# Altium project FHJController_V5.0.PrjPcb (part 2 of 2)

## Sheet Debugging Interface.SchDoc: Debugging Interface
size A3; DocumentNumber: 4; SheetNumber: 4; SheetTotal: 6
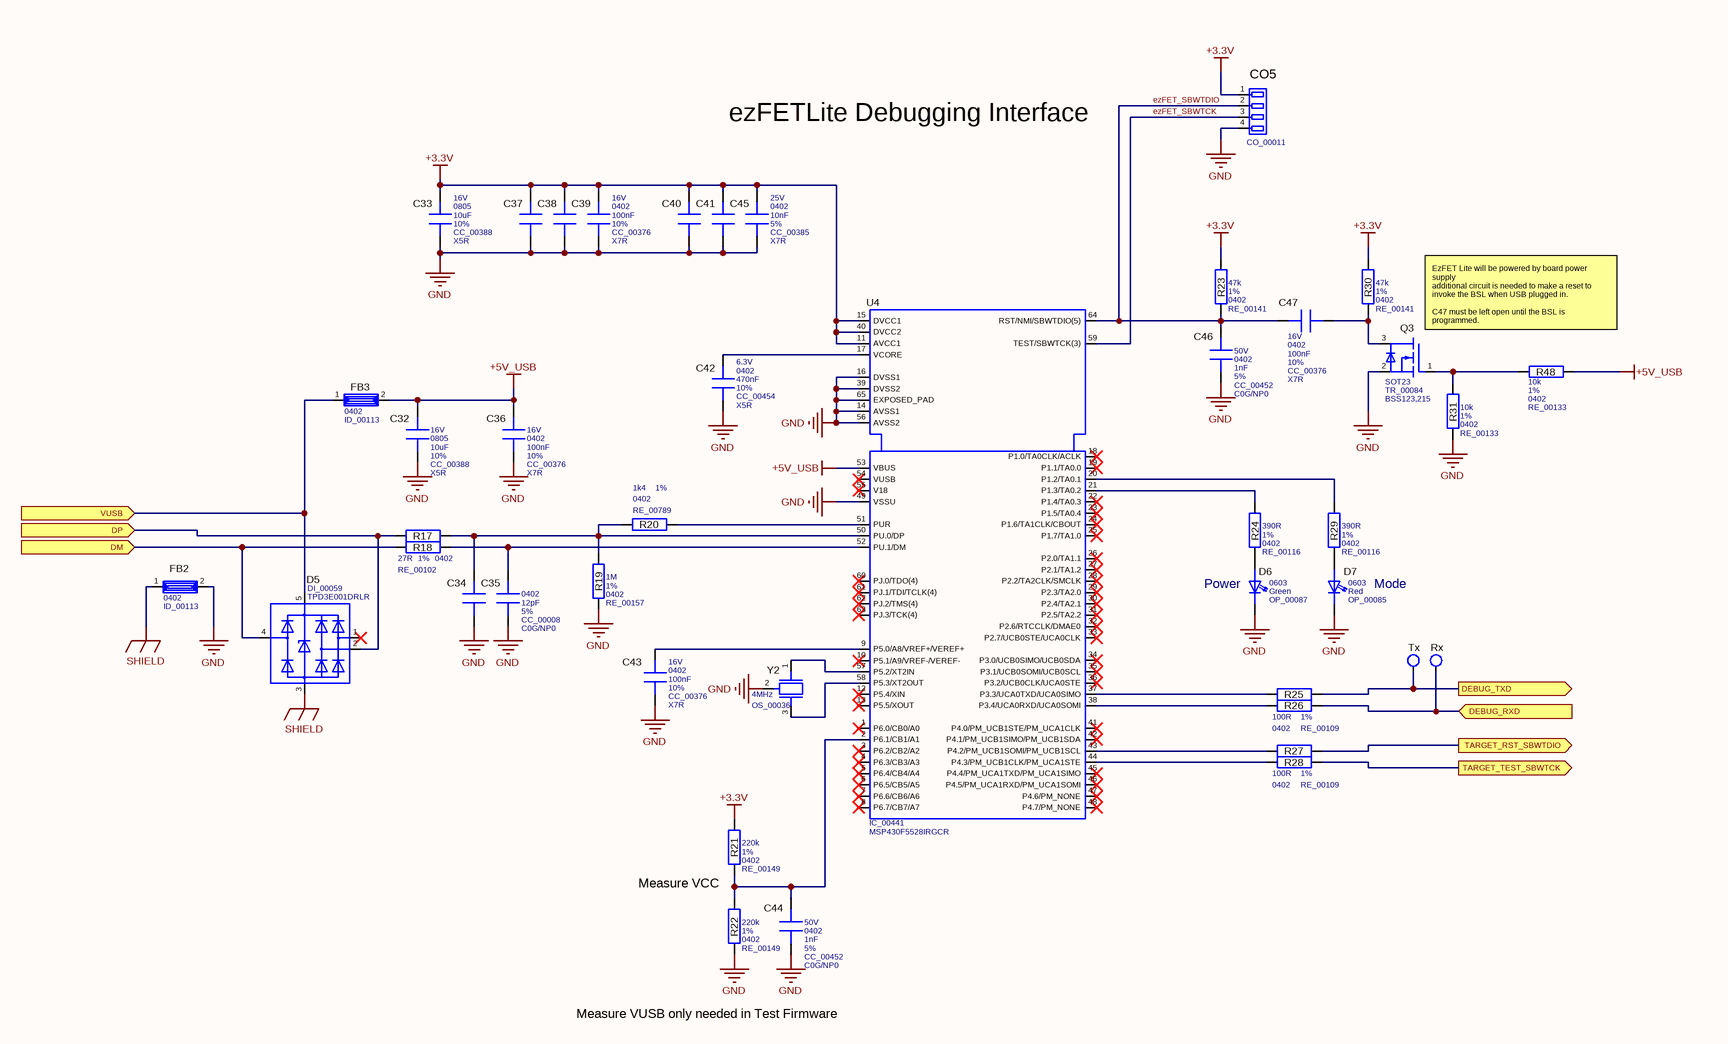
[diagram p4: Debugging Interface.SchDoc]

### Parts
C32  Voltage: 16V  Package: 0805  Capacitance: 10uF  Tolerance: 10%  Part_Number: CC_00388  Dielectric_Material: X5R  [CS2000x1250x1250x350x1650L]  (hidden comment: capacitor)
C33  Voltage: 16V  Package: 0805  Capacitance: 10uF  Tolerance: 10%  Part_Number: CC_00388  Dielectric_Material: X5R  [CS2000x1250x1250x350x1650L]  (hidden comment: capacitor)
C34  capacitor  [CS1000X500X560X250X820L]  (value not drawn)
C35  Package: 0402  Capacitance: 12pF  Tolerance: 5%  Part_Number: CC_00008  Dielectric_Material: C0G/NP0  [CS1000X500X560X250X820L]  (hidden comment: capacitor)
C36  Voltage: 16V  Package: 0402  Capacitance: 100nF  Tolerance: 10%  Part_Number: CC_00376  Dielectric_Material: X7R  [CS1000X500X560X250X820L]  (hidden comment: capacitor)
C37  capacitor  [CS1000X500X560X250X820L]  (value not drawn)
C38  capacitor  [CS1000X500X560X250X820L]  (value not drawn)
C39  Voltage: 16V  Package: 0402  Capacitance: 100nF  Tolerance: 10%  Part_Number: CC_00376  Dielectric_Material: X7R  [CS1000X500X560X250X820L]  (hidden comment: capacitor)
C40  capacitor  [CS1000X500X560X250X820L]  (value not drawn)
C41  capacitor  [CS1000X500X560X250X820L]  (value not drawn)
C42  Voltage: 6.3V  Package: 0402  Capacitance: 470nF  Tolerance: 10%  Part_Number: CC_00454  Dielectric_Material: X5R  [CS1000X500X560X250X820L]  (hidden comment: capacitor)
C43  Voltage: 16V  Package: 0402  Capacitance: 100nF  Tolerance: 10%  Part_Number: CC_00376  Dielectric_Material: X7R  [CS1000X500X560X250X820L]  (hidden comment: capacitor)
C44  Voltage: 50V  Package: 0402  Capacitance: 1nF  Tolerance: 5%  Part_Number: CC_00452  Dielectric_Material: C0G/NP0  [CS1000X500X560X250X820L]  (hidden comment: capacitor)
C45  Voltage: 25V  Package: 0402  Capacitance: 10nF  Tolerance: 5%  Part_Number: CC_00385  Dielectric_Material: X7R  [CS1000X500X560X250X820L]  (hidden comment: capacitor)
C46  Voltage: 50V  Package: 0402  Capacitance: 1nF  Tolerance: 5%  Part_Number: CC_00452  Dielectric_Material: C0G/NP0  [CS1000X500X560X250X820L]  (hidden comment: capacitor)
C47  Voltage: 16V  Package: 0402  Capacitance: 100nF  Tolerance: 10%  Part_Number: CC_00376  Dielectric_Material: X7R  [CS1000X500X560X250X820L]  (hidden comment: capacitor)
CO5  CO_00011  [CO_00011N]
D5  Manufacturer_Number: TPD3E001DRLR  [DI_00059N]  (hidden comment: DI_00059)
D6  Package: 0603  Color: Green  Part_Number: OP_00087  [OP_00087L]  (hidden comment: LED)
D7  Package: 0603  Color: Red  Part_Number: OP_00085  [OP_00085L]  (hidden comment: LED)
FB2  Package: 0402  Part_Number: ID_00113  [IS1000x500x500x200x800L]  (hidden comment: ferrit)
FB3  Package: 0402  Part_Number: ID_00113  [IS1000x500x500x200x800L]  (hidden comment: ferrit)
Q3  Package: SOT23  Part_Number: TR_00084  Manufacturer_Number: BSS123,215  [TR_00084N]  (hidden comment: nmosfet)
R17  Resistor  [RS1000X500X560X250X820L]  (value not drawn)
R18  Resistance: 27R  Tolerance: 1%  Package: 0402  Part_Number: RE_00102  [RS1000X500X560X250X820L]  (hidden comment: Resistor)
R19  Resistance: 1M  Tolerance: 1%  Package: 0402  Part_Number: RE_00157  [RS1000X500X560X250X820L]  (hidden comment: Resistor)
R20  Resistance: 1k4  Tolerance: 1%  Package: 0402  Part_Number: RE_00789  [RS1000X500X560X250X820L]  (hidden comment: Resistor)
R21  Resistance: 220k  Tolerance: 1%  Package: 0402  Part_Number: RE_00149  [RS1000X500X560X250X820L]  (hidden comment: Resistor)
R22  Resistance: 220k  Tolerance: 1%  Package: 0402  Part_Number: RE_00149  [RS1000X500X560X250X820L]  (hidden comment: Resistor)
R23  Resistance: 47k  Tolerance: 1%  Package: 0402  Part_Number: RE_00141  [RS1000X500X560X250X820L]  (hidden comment: Resistor)
R24  Resistance: 390R  Tolerance: 1%  Package: 0402  Part_Number: RE_00116  [RS1000X500X560X250X820L]  (hidden comment: Resistor)
R25  Resistor  [RS1000X500X560X250X820L]  (value not drawn)
R26  Resistance: 100R  Tolerance: 1%  Package: 0402  Part_Number: RE_00109  [RS1000X500X560X250X820L]  (hidden comment: Resistor)
R27  Resistor  [RS1000X500X560X250X820L]  (value not drawn)
R28  Resistance: 100R  Tolerance: 1%  Package: 0402  Part_Number: RE_00109  [RS1000X500X560X250X820L]  (hidden comment: Resistor)
R29  Resistance: 390R  Tolerance: 1%  Package: 0402  Part_Number: RE_00116  [RS1000X500X560X250X820L]  (hidden comment: Resistor)
R30  Resistance: 47k  Tolerance: 1%  Package: 0402  Part_Number: RE_00141  [RS1000X500X560X250X820L]  (hidden comment: Resistor)
R31  Resistance: 10k  Tolerance: 1%  Package: 0402  Part_Number: RE_00133  [RS1000X500X560X250X820L]  (hidden comment: Resistor)
R48  Resistance: 10k  Tolerance: 1%  Package: 0402  Part_Number: RE_00133  [RS1000X500X560X250X820L]  (hidden comment: Resistor)
Rx  testpoint  [CO_00057N]  (value not drawn)  (no BOM)
Tx  testpoint  [CO_00057N]  (value not drawn)  (no BOM)
U4  Manufacturer_Number: MSP430F5528IRGCR  [IC_00441N]  (hidden comment: IC_00441)
Y2  Part_Number: OS_00036  Nominal_frequency: 4MHz  [OS_00036N]  (hidden comment: ceramic_resonator)

### Ports
DEBUG_RXD (in), DEBUG_TXD (out), DM (in), DP (in), TARGET_RST_SBWTDIO (out), TARGET_TEST_SBWTCK (out), VUSB (in)

### Nets
+3.3V: C33.2(PIN2) C37.2(PIN2) C38.2(PIN2) C39.2(PIN2) C40.2(PIN2) C41.2(PIN2) C45.2(PIN2) CO5.1(PIN1) R21.2(PIN2) R23.2(PIN2) R30.2(PIN2) U4.11(AVCC1) U4.15(DVCC1) U4.40(DVCC2)
+5V_USB: C32.2(PIN2) C36.2(PIN2) FB3.2(PIN2) R48.1(PIN1) U4.53(VBUS)
GND: C32.1(PIN1) C33.1(PIN1) C34.1(PIN1) C35.1(PIN1) C36.1(PIN1) C37.1(PIN1) C38.1(PIN1) C39.1(PIN1) C40.1(PIN1) C41.1(PIN1) C42.1(PIN1) C43.1(PIN1) C44.1(PIN1) C45.1(PIN1) C46.1(PIN1) CO5.4(PIN4) D6.1(CATHODE) D7.1(CATHODE) FB2.2(PIN2) Q3.2(S) R19.1(PIN1) R22.1(PIN1) R31.1(PIN1) U4.14(AVSS1) U4.16(DVSS1) U4.39(DVSS2) U4.49(VSSU) U4.56(AVSS2) U4.65(EXPOSED_PAD) Y2.2(PIN2)
SHIELD: D5.3(GND) FB2.1(PIN1)
DEBUG_RXD: R26.2(PIN2) Rx.1(PIN1) ; port DEBUG_RXD
DEBUG_TXD: R25.2(PIN2) Tx.1(PIN1) ; port DEBUG_TXD
ezFET_SBWTCK: CO5.3(PIN3) U4.59(TEST/SBWTCK(3))
ezFET_SBWTDIO: C46.2(PIN2) C47.2(PIN2) CO5.2(PIN2) R23.1(PIN1) U4.64(RST/NMI/SBWTDIO(5))
TARGET_RST_SBWTDIO: R27.2(PIN2) ; port TARGET_RST_SBWTDIO
TARGET_TEST_SBWTCK: R28.2(PIN2) ; port TARGET_TEST_SBWTCK
VUSB: D5.5(VCC) FB3.1(PIN1) ; port VUSB
NetC34_2: C34.2(PIN2) R17.2(PIN2) R19.2(PIN2) R20.1(PIN1) U4.50(PU.0/DP)
NetC35_2: C35.2(PIN2) R18.2(PIN2) U4.52(PU.1/DM)
NetC42_2: C42.2(PIN2) U4.17(VCORE)
NetC43_2: C43.2(PIN2) U4.9(P5.0/A8/VREF+/VEREF+)
NetC44_2: C44.2(PIN2) R21.1(PIN1) R22.2(PIN2) U4.2(P6.1/CB1/A1)
NetC47_1: C47.1(PIN1) Q3.3(D) R30.1(PIN1)
NetCO12_2: D5.4(IO3) R18.1(PIN1) ; port DM
NetCO12_3: D5.2(IO2) R17.1(PIN1) ; port DP
NetD6_2: D6.2(ANODE) R24.1(PIN1)
NetD7_2: D7.2(ANODE) R29.1(PIN1)
NetQ3_1: Q3.1(G) R31.2(PIN2) R48.2(PIN2)
NetR20_2: R20.2(PIN2) U4.51(PUR)
NetR24_2: R24.2(PIN2) U4.21(P1.3/TA0.2)
NetR25_1: R25.1(PIN1) U4.37(P3.3/UCA0TXD/UCA0SIMO)
NetR26_1: R26.1(PIN1) U4.38(P3.4/UCA0RXD/UCA0SOMI)
NetR27_1: R27.1(PIN1) U4.43(P4.2/PM_UCB1SOMI/PM_UCB1SCL)
NetR28_1: R28.1(PIN1) U4.44(P4.3/PM_UCB1CLK/PM_UCA1STE)
NetR29_2: R29.2(PIN2) U4.20(P1.2/TA0.1)
NetU4_57: U4.57(P5.2/XT2IN) Y2.1(PIN1)
NetU4_58: U4.58(P5.3/XT2OUT) Y2.3(PIN3)

Not connected (* = marked no-connect by the designer): D5 1(IO1)*; U4 1(P6.0/CB0/A0)* 3(P6.2/CB2/A2)* 4(P6.3/CB3/A3)* 5(P6.4/CB4/A4)* 6(P6.5/CB5/A5)* 7(P6.6/CB6/A6)* 8(P6.7/CB7/A7)* 10(P5.1/A9/VREF-/VEREF-)* 12(P5.4/XIN)* 13(P5.5/XOUT)* 18(P1.0/TA0CLK/ACLK)* 19(P1.1/TA0.0)* 22(P1.4/TA0.3)* 23(P1.5/TA0.4)* 24(P1.6/TA1CLK/CBOUT)* 25(P1.7/TA1.0)* 26(P2.0/TA1.1)* 27(P2.1/TA1.2)* 28(P2.2/TA2CLK/SMCLK)* 29(P2.3/TA2.0)* 30(P2.4/TA2.1)* 31(P2.5/TA2.2)* 32(P2.6/RTCCLK/DMAE0)* 33(P2.7/UCB0STE/UCA0CLK)* 34(P3.0/UCB0SIMO/UCB0SDA)* 35(P3.1/UCB0SOMI/UCB0SCL)* 36(P3.2/UCB0CLK/UCA0STE)* 41(P4.0/PM_UCB1STE/PM_UCA1CLK)* 42(P4.1/PM_UCB1SIMO/PM_UCB1SDA)* 45(P4.4/PM_UCA1TXD/PM_UCA1SIMO)* 46(P4.5/PM_UCA1RXD/PM_UCA1SOMI)* 47(P4.6/PM_NONE)* 48(P4.7/PM_NONE)* 54(VUSB)* 55(V18)* 60(PJ.0/TDO(4))* 61(PJ.1/TDI/TCLK(4))* 62(PJ.2/TMS(4))* 63(PJ.3/TCK(4))*

### Notes on the sheet
- ezFETLite Debugging Interface
- (near Q3) EzFET Lite will be powered by board power supply
  additional circuit is needed to make a reset to
  invoke the BSL when USB plugged in.
  C47 must be left open until the BSL is programmed.
- (near D6) Power
- Mode
- Measure VCC
- Measure VUSB only needed in Test Firmware
- Size
- A3
- Rev
- Sheet
- of
- Date changed
- FH  JOANNEUM
- University of Applied Sciences
- Drawn by
- Title
- Check by

### Library data of the parts
C32 C33 = CC_00388: Part_Type: Fixed capacitors; Manufacturer_Number: GRM21BR61C106KE15L; Maximum_Capacitance: 0; Creator: Krenn Markus; Minimum_Capacitance: 0; Nominal_Voltage: 0; Creation_Date: 09.07.2012; Datasheet_Link: http://ibi/dxdb_partdatasheet_download.php?pid=388
C34 = CC_00008: Part_Type: Fixed capacitors; Manufacturer_Number: GRM1555C1H120JA01D; Voltage: 50V; Capacitance: 12pF; Tolerance: 5%; Dielectric_Material: C0G/NP0; Maximum_Capacitance: 0; Package: 0402; Creator: Krenn Markus; Part_Number: CC_00008; Minimum_Capacitance: 0; Nominal_Voltage: 0; Creation_Date: 09.07.2012; Datasheet_Link: http://ibi/dxdb_partdatasheet_download.php?pid=8
C35 = CC_00008: Part_Type: Fixed capacitors; Manufacturer_Number: GRM1555C1H120JA01D; Voltage: 50V; Maximum_Capacitance: 0; Creator: Krenn Markus; Minimum_Capacitance: 0; Nominal_Voltage: 0; Creation_Date: 09.07.2012; Datasheet_Link: http://ibi/dxdb_partdatasheet_download.php?pid=8
C36 C39 C43 C47 = CC_00376: Part_Type: Fixed capacitors; Manufacturer_Number: GRM155R71C104KA88D; Maximum_Capacitance: 0; Creator: Okorn Robert; Minimum_Capacitance: 0; Nominal_Voltage: 0; Creation_Date: 09.07.2012; Datasheet_Link: http://ibi/dxdb_partdatasheet_download.php?pid=376
C37 C38 = CC_00376: Part_Type: Fixed capacitors; Manufacturer_Number: GRM155R71C104KA88D; Voltage: 16V; Capacitance: 100nF; Tolerance: 10%; Dielectric_Material: X7R; Maximum_Capacitance: 0; Package: 0402; Creator: Okorn Robert; Part_Number: CC_00376; Minimum_Capacitance: 0; Nominal_Voltage: 0; Creation_Date: 09.07.2012; Datasheet_Link: http://ibi/dxdb_partdatasheet_download.php?pid=376
C40 C41 = CC_00385: Part_Type: Fixed capacitors; Manufacturer_Number: C0402C103J3RACTU; Voltage: 25V; Capacitance: 10nF; Tolerance: 5%; Dielectric_Material: X7R; Maximum_Capacitance: 0; Package: 0402; Creator: Neissl Gernot; Part_Number: CC_00385; Minimum_Capacitance: 0; Nominal_Voltage: 0; Creation_Date: 09.07.2012; Datasheet_Link: http://ibi/dxdb_partdatasheet_download.php?pid=385
C42 = CC_00454: Part_Type: Fixed capacitors; Manufacturer_Number: 04026D474KAT2A; Maximum_Capacitance: 0; Creator: Krenn Markus; Minimum_Capacitance: 0; Nominal_Voltage: 0; Creation_Date: 04.01.2013; Datasheet_Link: http://ibi/dxdb_partdatasheet_download.php?pid=2152
C44 C46 = CC_00452: Part_Type: Fixed capacitors; Manufacturer_Number: C1005C0G1H102J050BA; Maximum_Capacitance: 0; Creator: Krenn Markus; Minimum_Capacitance: 0; Nominal_Voltage: 0; Creation_Date: 04.01.2013; Datasheet_Link: http://ibi/dxdb_partdatasheet_download.php?pid=2150
C45 = CC_00385: Part_Type: Fixed capacitors; Manufacturer_Number: C0402C103J3RACTU; Maximum_Capacitance: 0; Creator: Neissl Gernot; Minimum_Capacitance: 0; Nominal_Voltage: 0; Creation_Date: 09.07.2012; Datasheet_Link: http://ibi/dxdb_partdatasheet_download.php?pid=385
CO5 = CO_00011: PinHeader4x1 RM2.54mm Molex; Manufacturer_Number: 90120-0124; Current: 3A; Impedance: 0R; Power: 0W; Connector_Type: Pin-Header; Function_type: Wire-to-Board; Connector_gender: male; Pitch_style: 0.00254m; Mounting_angle: 0°; Contact_Count: 4; Row_Count: 1; Contact_coating: Gold; Nominal_AC_Voltage: 350VAC; Nominal_DC_Voltage: 350VDC; Mounting: Through Hole; Material: Brass; Creator: Krenn Markus; Part_Number: CO_00011; Creation_Date: 09.07.2012; Datasheet_Link: http://ibi/dxdb_partdatasheet_download.php?pid=439
D5 = DI_00059: 3-CHANNEL ESD-PROTECTION DIODE ARRAY; Power: 0W; Diode_type: ESD Surpressor Diode; Reverse_Voltage: 5.5V; Current_DC: 0A; Diodes_per_package: 3; Forward_Voltage: 0V; Reverse-recovery_time: 0s; Package: 5SOT; Creator: Krenn Markus; Part_Number: DI_00059; Creation_Date: 09.07.2012; Datasheet_Link: http://ibi/dxdb_partdatasheet_download.php?pid=824
D6 = OP_00087: Manufacturer_Number: TLMG1100-GS08; Type: Standard; Isolating_voltage: 0; Creator: Krenn Markus; Part_Type: LED; Transistor_type: 0; Creation_Date: 23.05.2016; Datasheet_Link: http://ibi/dxdb_partdatasheet_download.php?pid=3140
D7 = OP_00085: Manufacturer_Number: TLMS1100-GS08; Type: Standard; Isolating_voltage: 0; Creator: Krenn Markus; Part_Type: LED; Transistor_type: 0; Creation_Date: 23.05.2016; Datasheet_Link: http://ibi/dxdb_partdatasheet_download.php?pid=3138
FB2 FB3 = ID_00113: Manufacturer_Number: 7427927121; Part_Type: Inductors; Inductance: 0H; Current_DC: 200mA; Creator: Kohl Martin; Creation_Date: 20.05.2014; Datasheet_Link: http://ibi/dxdb_partdatasheet_download.php?pid=2601
Q3 = TR_00084: Part_Type: MOSFET; Current: 0; Drain-Source_DC_current: 150mA; Drain-Source_Voltage: 100V; Creator: Weis Gerald; Collector-Emitter_voltage: 0; Reverse_voltage: 0; RMS_Current: 0; Creation_Date: 07.04.2016; Datasheet_Link: http://ibi/dxdb_partdatasheet_download.php?pid=3103
R17 = RE_00102: Manufacturer_Number: CRCW040227R0FKED; Part_Type: Fixed Resistors; Resistance: 27R; Tolerance: 1%; Maximum_Resistance: 0; Nominal_voltage: 50V; Package: 0402; Type: 0; Creator: Krenn Markus; Part_Number: RE_00102; Nominal_DC_Voltage: 0; Impact_current: 0; Creation_Date: 09.07.2012; Datasheet_Link: http://ibi/dxdb_partdatasheet_download.php?pid=1507
R18 = RE_00102: Manufacturer_Number: CRCW040227R0FKED; Part_Type: Fixed Resistors; Maximum_Resistance: 0; Nominal_voltage: 50V; Type: 0; Creator: Krenn Markus; Nominal_DC_Voltage: 0; Impact_current: 0; Creation_Date: 09.07.2012; Datasheet_Link: http://ibi/dxdb_partdatasheet_download.php?pid=1507
R19 = RE_00157: Manufacturer_Number: MC00625W040211M; Part_Type: Fixed Resistors; Maximum_Resistance: 0; Nominal_voltage: 50V; Type: 0; Creator: Krenn Markus; Nominal_DC_Voltage: 0; Impact_current: 0; Creation_Date: 09.07.2012; Datasheet_Link: http://ibi/dxdb_partdatasheet_download.php?pid=1562
R20 = RE_00789: Manufacturer_Number: MC00625W040211K4; Part_Type: Fixed Resistors; Maximum_Resistance: 0; Nominal_voltage: 50V; Type: 0; Nominal_DC_Voltage: 0; Impact_current: 0; Creator: Krenn Markus; Creation_Date: 05.07.2016; Datasheet_Link: http://ibi/dxdb_partdatasheet_download.php?pid=3205
R21 R22 = RE_00149: Manufacturer_Number: RC0402FR-07220KL; Part_Type: Fixed Resistors; Maximum_Resistance: 0; Nominal_voltage: 50V; Type: 0; Creator: Krenn Markus; Nominal_DC_Voltage: 0; Impact_current: 0; Creation_Date: 09.07.2012; Datasheet_Link: http://ibi/dxdb_partdatasheet_download.php?pid=1554
R23 R30 = RE_00141: Manufacturer_Number: MC00625W0402147K; Part_Type: Fixed Resistors; Maximum_Resistance: 0; Nominal_voltage: 50V; Type: 0; Creator: Krenn Markus; Nominal_DC_Voltage: 0; Impact_current: 0; Creation_Date: 09.07.2012; Datasheet_Link: http://ibi/dxdb_partdatasheet_download.php?pid=1546
R24 R29 = RE_00116: Manufacturer_Number: MC00625W04021390R; Part_Type: Fixed Resistors; Maximum_Resistance: 0; Nominal_voltage: 50V; Type: 0; Creator: Krenn Markus; Nominal_DC_Voltage: 0; Impact_current: 0; Creation_Date: 09.07.2012; Datasheet_Link: http://ibi/dxdb_partdatasheet_download.php?pid=1521
R25 R27 = RE_00109: Manufacturer_Number: RC0402FR-07100RL; Part_Type: Fixed Resistors; Resistance: 100R; Tolerance: 1%; Maximum_Resistance: 0; Nominal_voltage: 50V; Package: 0402; Type: 0; Creator: Krenn Markus; Part_Number: RE_00109; Nominal_DC_Voltage: 0; Impact_current: 0; Creation_Date: 09.07.2012; Datasheet_Link: http://ibi/dxdb_partdatasheet_download.php?pid=1514
R26 R28 = RE_00109: Manufacturer_Number: RC0402FR-07100RL; Part_Type: Fixed Resistors; Maximum_Resistance: 0; Nominal_voltage: 50V; Type: 0; Creator: Krenn Markus; Nominal_DC_Voltage: 0; Impact_current: 0; Creation_Date: 09.07.2012; Datasheet_Link: http://ibi/dxdb_partdatasheet_download.php?pid=1514
R31 R48 = RE_00133: Manufacturer_Number: MC00625W0402110K; Part_Type: Fixed Resistors; Maximum_Resistance: 0; Nominal_voltage: 50V; Type: 0; Nominal_DC_Voltage: 0; Impact_current: 0; Creator: Krenn Markus; Creation_Date: 09.07.2012; Datasheet_Link: http://ibi/dxdb_partdatasheet_download.php?pid=1538
Rx Tx = CO_00057: Testpoint 1.6mm Bohrung 1mm; Current: 0A; Impedance: 0R; Nominal_AC_Voltage: 0VAC; Nominal_DC_Voltage: 0VDC; Power: 0W; Part_Number: CO_00057; Manufacturer_Number: Testpoint; Connector_Type: Testpoint; Creator: Sirnik Heimo; Creation_Date: 09.07.2012; Datasheet_Link: http://ibi/dxdb_partdatasheet_download.php?pid=485
U4 = IC_00441: MSP430F5528IRGCR - MIXED SIGNAL MICROCONTROLLER; Part_Type: Microcontrollers/Processors; Creator: Krenn Markus; Part_Number: IC_00441; Creation_Date: 20.02.2014; Datasheet_Link: http://ibi/dxdb_partdatasheet_download.php?pid=2466
Y2 = OS_00036: Manufacturer_Number: CSTCR4M00G53-R0; Part_Type: Crystal; Tolerance: 100ppm; Creator: Krenn Markus; Creation_Date: 20.02.2014; Datasheet_Link: http://ibi/dxdb_partdatasheet_download.php?pid=2501

## Sheet Sensors.SchDoc: Sensors
size A3; PageSetup: Record=PageOptions|CenterHorizontal=True|CenterVertical=True|PrintScale=1.00|XCorrection=1.00|YCorrection=1.00|PrintKind=1|BorderSize=5000000|LeftOffset=0|BottomOffset=0|Orientation=2|PaperLength=1000|PaperWidth=1000|Scale=100|PaperSource=7|PrintQuality=-3|MediaType=1|DitherType=10|PrintScaleMode=1|PaperKind=A3|PaperIndex=8; DocumentNumber: 5; SheetNumber: 5; SheetTotal: 6
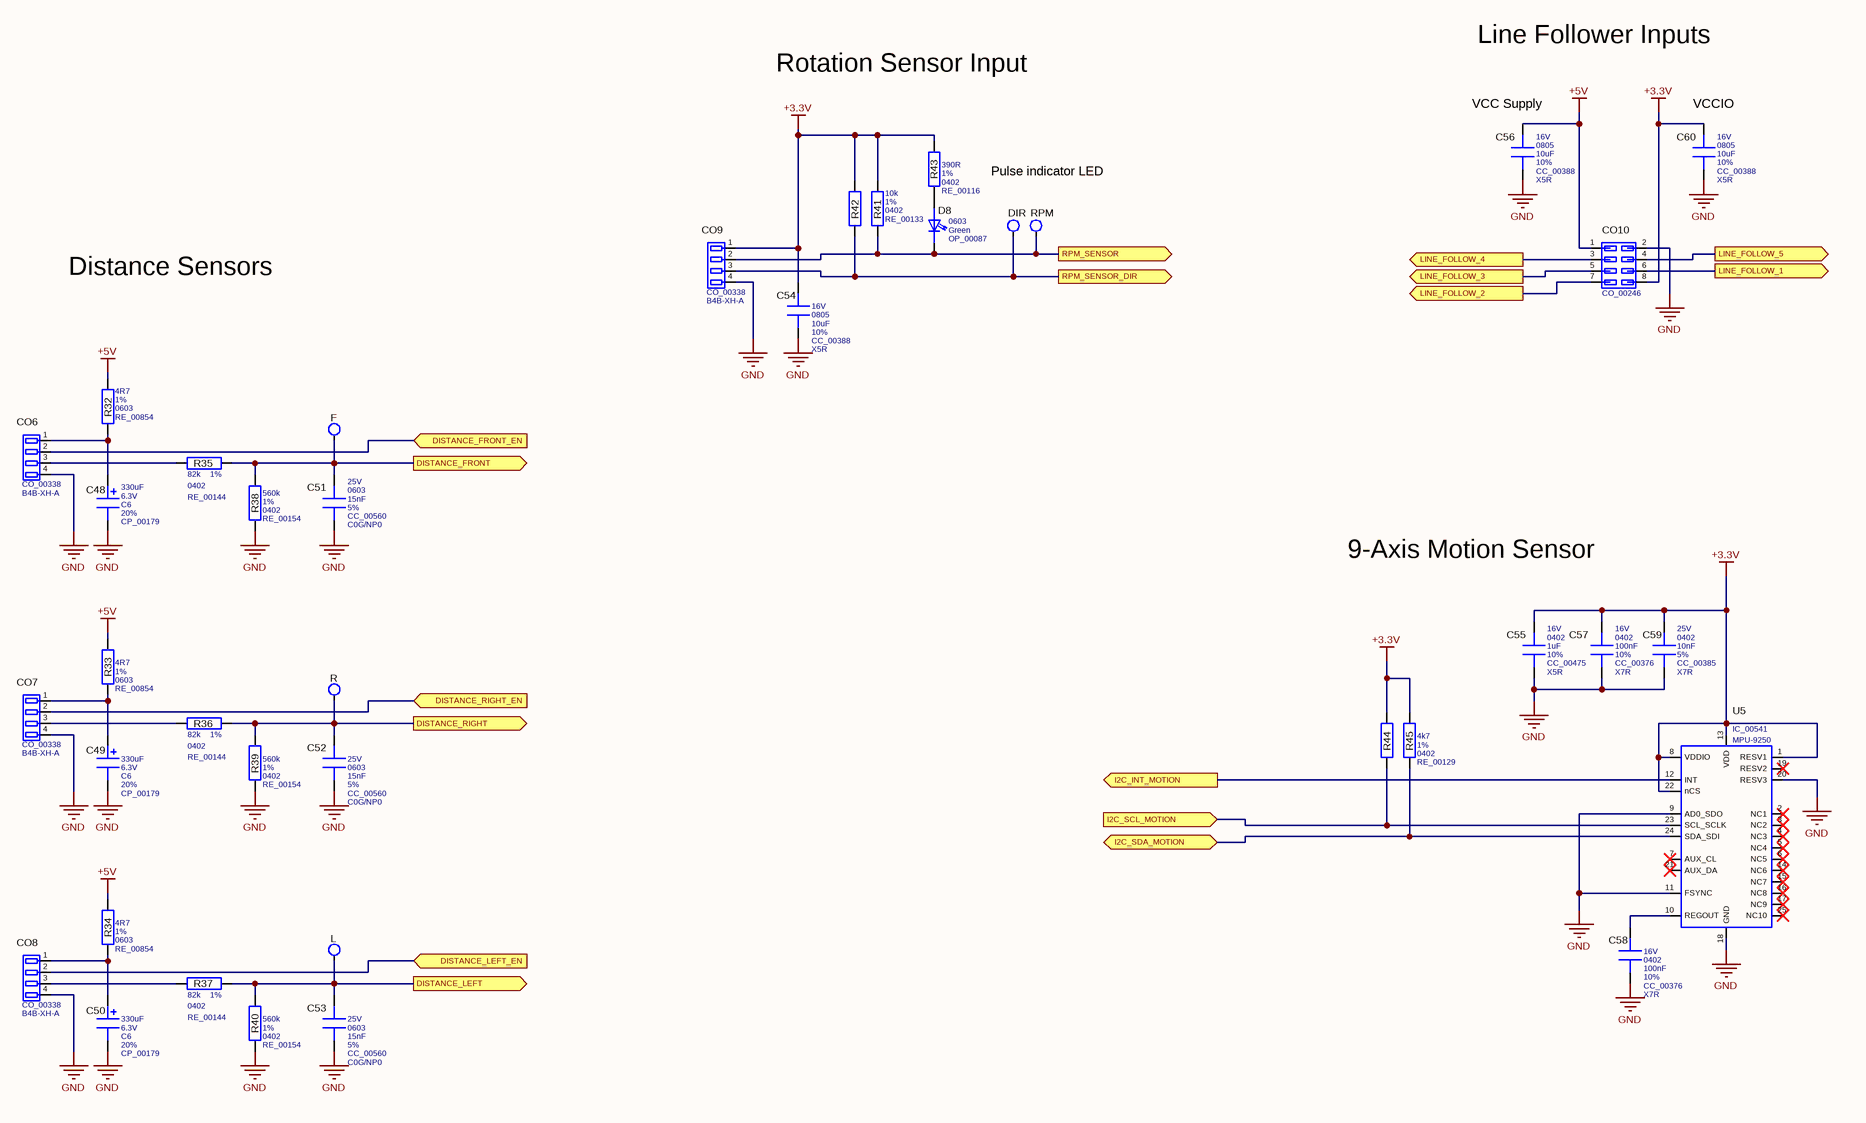
[diagram p5: Sensors.SchDoc]

### Parts
C48  Capacitance: 330uF  Voltage: 6.3V  Package: C6  Tolerance: 20%  Part_Number: CP_00179  [CP_00179L]  (hidden comment: capacitor_polar)
C49  Capacitance: 330uF  Voltage: 6.3V  Package: C6  Tolerance: 20%  Part_Number: CP_00179  [CP_00179L]  (hidden comment: capacitor_polar)
C50  Capacitance: 330uF  Voltage: 6.3V  Package: C6  Tolerance: 20%  Part_Number: CP_00179  [CP_00179L]  (hidden comment: capacitor_polar)
C51  Voltage: 25V  Package: 0603  Capacitance: 15nF  Tolerance: 5%  Part_Number: CC_00560  Dielectric_Material: C0G/NP0  [CS1600X800X900X350X1250L]  (hidden comment: capacitor)
C52  Voltage: 25V  Package: 0603  Capacitance: 15nF  Tolerance: 5%  Part_Number: CC_00560  Dielectric_Material: C0G/NP0  [CS1600X800X900X350X1250L]  (hidden comment: capacitor)
C53  Voltage: 25V  Package: 0603  Capacitance: 15nF  Tolerance: 5%  Part_Number: CC_00560  Dielectric_Material: C0G/NP0  [CS1600X800X900X350X1250L]  (hidden comment: capacitor)
C54  Voltage: 16V  Package: 0805  Capacitance: 10uF  Tolerance: 10%  Part_Number: CC_00388  Dielectric_Material: X5R  [CS2000x1250x1250x350x1650L]  (hidden comment: capacitor)
C55  Voltage: 16V  Package: 0402  Capacitance: 1uF  Tolerance: 10%  Part_Number: CC_00475  Dielectric_Material: X5R  [CS1000X500X560X250X820L]  (hidden comment: capacitor)
C56  Voltage: 16V  Package: 0805  Capacitance: 10uF  Tolerance: 10%  Part_Number: CC_00388  Dielectric_Material: X5R  [CS2000x1250x1250x350x1650L]  (hidden comment: capacitor)
C57  Voltage: 16V  Package: 0402  Capacitance: 100nF  Tolerance: 10%  Part_Number: CC_00376  Dielectric_Material: X7R  [CS1000X500X560X250X820L]  (hidden comment: capacitor)
C58  Voltage: 16V  Package: 0402  Capacitance: 100nF  Tolerance: 10%  Part_Number: CC_00376  Dielectric_Material: X7R  [CS1000X500X560X250X820L]  (hidden comment: capacitor)
C59  Voltage: 25V  Package: 0402  Capacitance: 10nF  Tolerance: 5%  Part_Number: CC_00385  Dielectric_Material: X7R  [CS1000X500X560X250X820L]  (hidden comment: capacitor)
C60  Voltage: 16V  Package: 0805  Capacitance: 10uF  Tolerance: 10%  Part_Number: CC_00388  Dielectric_Material: X5R  [CS2000x1250x1250x350x1650L]  (hidden comment: capacitor)
CO6  Part_Number: CO_00338  Manufacturer_Number: B4B-XH-A  [CO_00338N]  (hidden comment: header1x4)
CO7  Part_Number: CO_00338  Manufacturer_Number: B4B-XH-A  [CO_00338N]  (hidden comment: header1x4)
CO8  Part_Number: CO_00338  Manufacturer_Number: B4B-XH-A  [CO_00338N]  (hidden comment: header1x4)
CO9  Part_Number: CO_00338  Manufacturer_Number: B4B-XH-A  [CO_00338N]  (hidden comment: header1x4)
CO10  Part_Number: CO_00246  [CO_00246N]  (hidden comment: header2x4)
D8  Package: 0603  Color: Green  Part_Number: OP_00087  [OP_00087L]  (hidden comment: LED)
DIR  testpoint  [CO_00057N]  (value not drawn)  (no BOM)
F  testpoint  [CO_00057N]  (value not drawn)  (no BOM)
L  testpoint  [CO_00057N]  (value not drawn)  (no BOM)
R  testpoint  [CO_00057N]  (value not drawn)  (no BOM)
R32  Resistance: 4R7  Tolerance: 1%  Package: 0603  Part_Number: RE_00854  [RS1600X850X450X300X1300L]  (hidden comment: Resistor)
R33  Resistance: 4R7  Tolerance: 1%  Package: 0603  Part_Number: RE_00854  [RS1600X850X450X300X1300L]  (hidden comment: Resistor)
R34  Resistance: 4R7  Tolerance: 1%  Package: 0603  Part_Number: RE_00854  [RS1600X850X450X300X1300L]  (hidden comment: Resistor)
R35  Resistance: 82k  Tolerance: 1%  Package: 0402  Part_Number: RE_00144  [RS1000X500X560X250X820L]  (hidden comment: Resistor)
R36  Resistance: 82k  Tolerance: 1%  Package: 0402  Part_Number: RE_00144  [RS1000X500X560X250X820L]  (hidden comment: Resistor)
R37  Resistance: 82k  Tolerance: 1%  Package: 0402  Part_Number: RE_00144  [RS1000X500X560X250X820L]  (hidden comment: Resistor)
R38  Resistance: 560k  Tolerance: 1%  Package: 0402  Part_Number: RE_00154  [RS1000X500X560X250X820L]  (hidden comment: Resistor)
R39  Resistance: 560k  Tolerance: 1%  Package: 0402  Part_Number: RE_00154  [RS1000X500X560X250X820L]  (hidden comment: Resistor)
R40  Resistance: 560k  Tolerance: 1%  Package: 0402  Part_Number: RE_00154  [RS1000X500X560X250X820L]  (hidden comment: Resistor)
R41  Resistance: 10k  Tolerance: 1%  Package: 0402  Part_Number: RE_00133  [RS1000X500X560X250X820L]  (hidden comment: Resistor)
R42  Resistor  [RS1000X500X560X250X820L]  (value not drawn)
R43  Resistance: 390R  Tolerance: 1%  Package: 0402  Part_Number: RE_00116  [RS1000X500X560X250X820L]  (hidden comment: Resistor)
R44  Resistor  [RS1000X500X560X250X820L]  (value not drawn)
R45  Resistance: 4k7  Tolerance: 1%  Package: 0402  Part_Number: RE_00129  [RS1000X500X560X250X820L]  (hidden comment: Resistor)
RPM  testpoint  [CO_00057N]  (value not drawn)  (no BOM)
U5  Manufacturer_Number: MPU-9250  [IC_00541N]  (hidden comment: IC_00541)

### Ports
DISTANCE_FRONT (out), DISTANCE_FRONT_EN (in), DISTANCE_LEFT (out), DISTANCE_LEFT_EN (in), DISTANCE_RIGHT (out), DISTANCE_RIGHT_EN (in), I2C_INT_MOTION (out), I2C_SCL_MOTION (in), I2C_SDA_MOTION (bidir), LINE_FOLLOW_1 (out), LINE_FOLLOW_2 (out), LINE_FOLLOW_3 (out), LINE_FOLLOW_4 (out), LINE_FOLLOW_5 (out), RPM_SENSOR (out), RPM_SENSOR_DIR (out)

### Nets
+3.3V: C54.2(PIN2) C55.2(PIN2) C57.2(PIN2) C59.2(PIN2) C60.2(PIN2) CO9.1(PIN1) CO10.8(PIN8) R41.2(PIN2) R42.2(PIN2) R43.2(PIN2) R44.2(PIN2) R45.2(PIN2) U5.1(RESV1) U5.8(VDDIO) U5.13(VDD) U5.22(nCS)
+5V: C56.2(PIN2) CO10.1(PIN1) R32.2(PIN2) R33.2(PIN2) R34.2(PIN2)
GND: C48.2(PIN2) C49.2(PIN2) C50.2(PIN2) C51.1(PIN1) C52.1(PIN1) C53.1(PIN1) C54.1(PIN1) C55.1(PIN1) C56.1(PIN1) C57.1(PIN1) C58.1(PIN1) C59.1(PIN1) C60.1(PIN1) CO6.4(PIN4) CO7.4(PIN4) CO8.4(PIN4) CO9.4(PIN4) CO10.2(PIN2) R38.1(PIN1) R39.1(PIN1) R40.1(PIN1) U5.9(AD0_SDO) U5.11(FSYNC) U5.18(GND) U5.20(RESV3)
DISTANCE_FRONT: C51.2(PIN2) F.1(PIN1) R35.2(PIN2) R38.2(PIN2) ; port DISTANCE_FRONT
DISTANCE_FRONT_EN: CO6.2(PIN2) ; port DISTANCE_FRONT_EN
DISTANCE_LEFT: C53.2(PIN2) L.1(PIN1) R37.2(PIN2) R40.2(PIN2) ; port DISTANCE_LEFT
DISTANCE_LEFT_EN: CO8.2(PIN2) ; port DISTANCE_LEFT_EN
DISTANCE_RIGHT: C52.2(PIN2) R.1(PIN1) R36.2(PIN2) R39.2(PIN2) ; port DISTANCE_RIGHT
DISTANCE_RIGHT_EN: CO7.2(PIN2) ; port DISTANCE_RIGHT_EN
I2C_INT_MOTION: U5.12(INT) ; port I2C_INT_MOTION
I2C_SCL_MOTION: R44.1(PIN1) U5.23(SCL_SCLK) ; port I2C_SCL_MOTION
I2C_SDA_MOTION: R45.1(PIN1) U5.24(SDA_SDI) ; port I2C_SDA_MOTION
LINE_FOLLOW_1: CO10.6(PIN6) ; port LINE_FOLLOW_1
LINE_FOLLOW_2: CO10.7(PIN7) ; port LINE_FOLLOW_2
LINE_FOLLOW_3: CO10.5(PIN5) ; port LINE_FOLLOW_3
LINE_FOLLOW_4: CO10.3(PIN3) ; port LINE_FOLLOW_4
LINE_FOLLOW_5: CO10.4(PIN4) ; port LINE_FOLLOW_5
RPM_SENSOR: CO9.2(PIN2) D8.1(CATHODE) R41.1(PIN1) RPM.1(PIN1) ; port RPM_SENSOR
RPM_SENSOR_DIR: CO9.3(PIN3) DIR.1(PIN1) R42.1(PIN1) ; port RPM_SENSOR_DIR
NetC48_1: C48.1(PIN1) CO6.1(PIN1) R32.1(PIN1)
NetC49_1: C49.1(PIN1) CO7.1(PIN1) R33.1(PIN1)
NetC50_1: C50.1(PIN1) CO8.1(PIN1) R34.1(PIN1)
NetC58_2: C58.2(PIN2) U5.10(REGOUT)
NetCO6_3: CO6.3(PIN3) R35.1(PIN1)
NetCO7_3: CO7.3(PIN3) R36.1(PIN1)
NetCO8_3: CO8.3(PIN3) R37.1(PIN1)
NetD8_2: D8.2(ANODE) R43.1(PIN1)

Not connected (* = marked no-connect by the designer): U5 2(NC1)* 3(NC2)* 4(NC3)* 5(NC4)* 6(NC5)* 7(AUX_CL)* 14(NC6)* 15(NC7)* 16(NC8)* 17(NC9)* 19(RESV2)* 21(AUX_DA)* 25(NC10)*

### Notes on the sheet
- Line Follower Inputs
- Rotation Sensor Input
- (near C56) VCC Supply
- (near C60) VCCIO
- Pulse indicator LED
- Distance Sensors
- 9-Axis Motion Sensor
- Size
- A3
- Rev
- Sheet
- of
- Date changed
- FH  JOANNEUM
- University of Applied Sciences
- Drawn by
- Title
- Check by

### Library data of the parts
C48-C50 = CP_00179: Manufacturer_Number: 875105144010; ESR: 0R02; Dielectric_Material: Conductive Polymer Aluminum Solid; Creator: Krenn Markus; Creation_Date: 13.06.2016; Datasheet_Link: http://ibi/dxdb_partdatasheet_download.php?pid=3183
C51-C53 = CC_00560: Part_Type: Fixed capacitors; Manufacturer_Number: C0603C153J3GACTU; Maximum_Capacitance: 0; Creator: Krenn Markus; Minimum_Capacitance: 0; Nominal_Voltage: 0; Creation_Date: 13.06.2016; Datasheet_Link: http://ibi/dxdb_partdatasheet_download.php?pid=3182
C54 C56 C60 = CC_00388: as C32 on sheet Debugging Interface; Creator: Krenn Markus; Minimum_Capacitance: 0; Nominal_Voltage: 0; Creation_Date: 09.07.2012; Datasheet_Link: http://ibi/dxdb_partdatasheet_download.php?pid=388
C55 = CC_00475: Part_Type: Fixed capacitors; Manufacturer_Number: C1005X5R1C105K050BC; Maximum_Capacitance: 0; Creator: Krenn Markus; Minimum_Capacitance: 0; Nominal_Voltage: 0; Creation_Date: 29.01.2014; Datasheet_Link: http://ibi/dxdb_partdatasheet_download.php?pid=2355
C57 C58 = CC_00376: as C36 on sheet Debugging Interface; Creator: Okorn Robert; Minimum_Capacitance: 0; Nominal_Voltage: 0; Creation_Date: 09.07.2012; Datasheet_Link: http://ibi/dxdb_partdatasheet_download.php?pid=376
C59 = CC_00385: as C45 on sheet Debugging Interface; Creator: Neissl Gernot; Minimum_Capacitance: 0; Nominal_Voltage: 0; Creation_Date: 09.07.2012; Datasheet_Link: http://ibi/dxdb_partdatasheet_download.php?pid=385
CO6-CO9 = CO_00338: XH connector - Disconnectable Crimp style connectors; Current: 3A; Impedance: 0R01; Power: 0W; Connector_Type: Pin-Header; Function_type: Wire-to-Board; Connector_gender: male; Pitch_style: 0.0025m; Mounting_angle: 0°; Contact_Count: 4; Row_Count: 1; Contact_coating: Tin; Nominal_AC_Voltage: 250VAC; Nominal_DC_Voltage: 250VDC; Mounting: Through Hole; Material: Copper-Alloy; Creator: Krenn Markus; Creation_Date: 15.06.2016; Datasheet_Link: http://ibi/dxdb_partdatasheet_download.php?pid=3185
CO10 = CO_00246: SMT .025" SQ POST HEADER; Manufacturer_Number: TSM-104-01-T-DV; Current: 6A; Impedance: 0R; Power: 0W; Connector_Type: Pin-Header; Function_type: Board-to-Board; Connector_gender: male; Pitch_style: 0.00254m; Mounting_angle: 0°; Contact_Count: 8; Row_Count: 2; Contact_coating: Tin; Nominal_AC_Voltage: 475VAC; Nominal_DC_Voltage: 475VDC; Mounting: SMD; Material: Phosphor-Bronze; Creator: Krenn Markus; Creation_Date: 30.01.2014; Datasheet_Link: http://ibi/dxdb_partdatasheet_download.php?pid=2391
D8 = OP_00087: as D6 on sheet Debugging Interface; Creator: Krenn Markus; Part_Type: LED; Transistor_type: 0; Creation_Date: 23.05.2016; Datasheet_Link: http://ibi/dxdb_partdatasheet_download.php?pid=3140
DIR F L R RPM = CO_00057: as Rx on sheet Debugging Interface; Part_Number: CO_00057; Manufacturer_Number: Testpoint; Connector_Type: Testpoint; Creator: Sirnik Heimo; Creation_Date: 09.07.2012; Datasheet_Link: http://ibi/dxdb_partdatasheet_download.php?pid=485
R32-R34 = RE_00854: Manufacturer_Number: MCWR06W4R70FTL; Part_Type: Fixed Resistors; Maximum_Resistance: 0; Nominal_voltage: 50V; Type: 0; Nominal_DC_Voltage: 0; Impact_current: 0; Creator: Krenn Markus; Creation_Date: 25.04.2017; Datasheet_Link: http://ibi/dxdb_partdatasheet_download.php?pid=3543
R35-R37 = RE_00144: Manufacturer_Number: MC00625W0402182K; Part_Type: Fixed Resistors; Maximum_Resistance: 0; Nominal_voltage: 50V; Type: 0; Creator: Krenn Markus; Nominal_DC_Voltage: 0; Impact_current: 0; Creation_Date: 09.07.2012; Datasheet_Link: http://ibi/dxdb_partdatasheet_download.php?pid=1549
R38-R40 = RE_00154: Manufacturer_Number: MC00625W04021560K; Part_Type: Fixed Resistors; Maximum_Resistance: 0; Nominal_voltage: 50V; Type: 0; Nominal_DC_Voltage: 0; Impact_current: 0; Creator: Krenn Markus; Creation_Date: 09.07.2012; Datasheet_Link: http://ibi/dxdb_partdatasheet_download.php?pid=1559
R41 = RE_00133: as R31 on sheet Debugging Interface; Type: 0; Creator: Krenn Markus; Nominal_DC_Voltage: 0; Impact_current: 0; Creation_Date: 09.07.2012; Datasheet_Link: http://ibi/dxdb_partdatasheet_download.php?pid=1538
R42 = RE_00133: Manufacturer_Number: MC00625W0402110K; Part_Type: Fixed Resistors; Resistance: 10k; Tolerance: 1%; Maximum_Resistance: 0; Nominal_voltage: 50V; Package: 0402; Type: 0; Creator: Krenn Markus; Part_Number: RE_00133; Nominal_DC_Voltage: 0; Impact_current: 0; Creation_Date: 09.07.2012; Datasheet_Link: http://ibi/dxdb_partdatasheet_download.php?pid=1538
R43 = RE_00116: as R24 on sheet Debugging Interface; Type: 0; Creator: Krenn Markus; Nominal_DC_Voltage: 0; Impact_current: 0; Creation_Date: 09.07.2012; Datasheet_Link: http://ibi/dxdb_partdatasheet_download.php?pid=1521
R44 = RE_00129: Manufacturer_Number: MC00625W040214K7; Part_Type: Fixed Resistors; Resistance: 4k7; Tolerance: 1%; Maximum_Resistance: 0; Nominal_voltage: 50V; Package: 0402; Type: 0; Creator: Krenn Markus; Part_Number: RE_00129; Nominal_DC_Voltage: 0; Impact_current: 0; Creation_Date: 09.07.2012; Datasheet_Link: http://ibi/dxdb_partdatasheet_download.php?pid=1534
R45 = RE_00129: Manufacturer_Number: MC00625W040214K7; Part_Type: Fixed Resistors; Maximum_Resistance: 0; Nominal_voltage: 50V; Type: 0; Creator: Krenn Markus; Nominal_DC_Voltage: 0; Impact_current: 0; Creation_Date: 09.07.2012; Datasheet_Link: http://ibi/dxdb_partdatasheet_download.php?pid=1534
U5 = IC_00541: MPU-9250 - GYRO/ACCEL/COMPASS, 9ACHSEN, I2C, QFN-24; Part_Type: Miscellaneous ICs; Creator: Sirnik Heimo; Part_Number: IC_00541; Creation_Date: 07.01.2015; Datasheet_Link: http://ibi/dxdb_partdatasheet_download.php?pid=2797

## Sheet Display and IOs.SchDoc: Display and IOs
size A3; DocumentNumber: 6; SheetNumber: 6; SheetTotal: 6
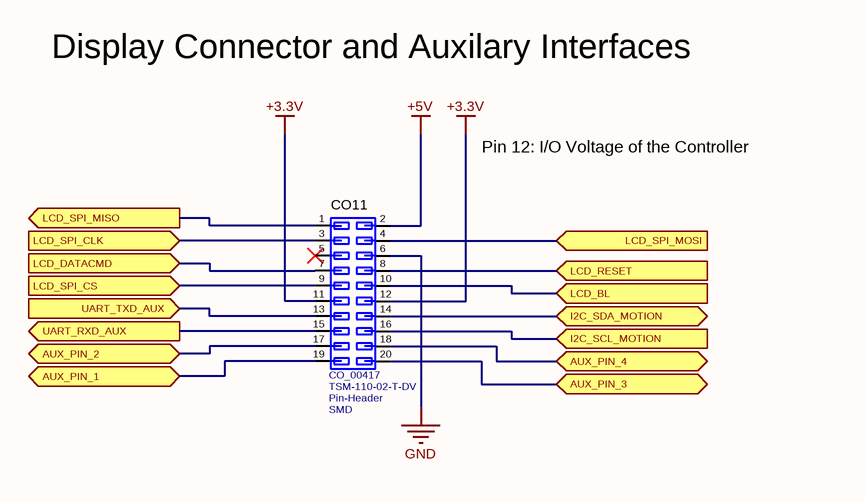
[diagram p6: Display and IOs.SchDoc]

### Parts
CO11  Part_Number: CO_00417  Manufacturer_Number: TSM-110-02-T-DV  Connector_Type: Pin-Header  Mounting: SMD  [CO_00417N]  (hidden comment: header2x10)

### Ports
AUX_PIN_1 (bidir), AUX_PIN_2 (bidir), AUX_PIN_3 (bidir), AUX_PIN_4 (bidir), I2C_SCL_MOTION (in), I2C_SDA_MOTION (bidir), LCD_BL (in), LCD_DATACMD (in), LCD_RESET (in), LCD_SPI_CLK (in), LCD_SPI_CS (in), LCD_SPI_MISO (out), LCD_SPI_MOSI (in), UART_RXD_AUX (out), UART_TXD_AUX (in)

### Nets
+3.3V: CO11.11(PIN11) CO11.12(PIN12)
+5V: CO11.2(PIN2)
GND: CO11.6(PIN6)
AUX_PIN_1: CO11.19(PIN19) ; port AUX_PIN_1
AUX_PIN_2: CO11.17(PIN17) ; port AUX_PIN_2
AUX_PIN_3: CO11.20(PIN20) ; port AUX_PIN_3
AUX_PIN_4: CO11.18(PIN18) ; port AUX_PIN_4
I2C_SCL_MOTION: CO11.16(PIN16) ; port I2C_SCL_MOTION
I2C_SDA_MOTION: CO11.14(PIN14) ; port I2C_SDA_MOTION
LCD_BL: CO11.10(PIN10) ; port LCD_BL
LCD_DATACMD: CO11.7(PIN7) ; port LCD_DATACMD
LCD_RESET: CO11.8(PIN8) ; port LCD_RESET
LCD_SPI_CLK: CO11.3(PIN3) ; port LCD_SPI_CLK
LCD_SPI_CS: CO11.9(PIN9) ; port LCD_SPI_CS
LCD_SPI_MISO: CO11.1(PIN1) ; port LCD_SPI_MISO
LCD_SPI_MOSI: CO11.4(PIN4) ; port LCD_SPI_MOSI
UART_RXD_AUX: CO11.15(PIN15) ; port UART_RXD_AUX
UART_TXD_AUX: CO11.13(PIN13) ; port UART_TXD_AUX

Not connected (* = marked no-connect by the designer): CO11 5(PIN5)*

### Notes on the sheet
- Display Connector and Auxilary Interfaces
- Pin 12: I/O Voltage of the Controller
- Size
- A3
- Rev
- Sheet
- of
- Date changed
- FH  JOANNEUM
- University of Applied Sciences
- Drawn by
- Title
- Check by

### Library data of the parts
CO11 = CO_00417: SMT .025" SQ POST HEADER; Function_type: Wire-to-Board; Connector_gender: male; Pitch_style: 0.00254m; Mounting_angle: 0°; Contact_Count: 20; Row_Count: 2; Contact_coating: Gold; Current: 5.4A; Impedance: 0R; Nominal_AC_Voltage: 475VAC; Nominal_DC_Voltage: 475VDC; Power: 0W; Material: Phosphor-Bronze; Creator: Krenn Markus; Creation_Date: 25.04.2017; Datasheet_Link: http://ibi/dxdb_partdatasheet_download.php?pid=3544

## Nets that join several sheets
+3.3V: Power Supply (5 pins), Controller Core (19 pins), Debugging Interface (14 pins), Sensors (16 pins), Display and IOs (CO11.11 CO11.12)
+5V: Power Supply (8 pins), Sensors (5 pins), Display and IOs (CO11.2)
+5V_USB: Power Supply (D2.2), Debugging Interface (5 pins)
GND: FHJController_V5.0_Main (C61.2 CO12.5 CO13.2 CO14.2), Power Supply (27 pins), Controller Core (36 pins), Debugging Interface (30 pins), Sensors (25 pins), Display and IOs (CO11.6)
SHIELD: FHJController_V5.0_Main (6 pins), Debugging Interface (D5.3 FB2.1)
VBEC: Power Supply (R5.2), Controller Core (5 pins)
AUX_PIN_1: Controller Core (U3.19), Display and IOs (CO11.19)
AUX_PIN_2: Controller Core (U3.20), Display and IOs (CO11.17)
AUX_PIN_3: Controller Core (U3.21), Display and IOs (CO11.20)
AUX_PIN_4: Controller Core (U3.22), Display and IOs (CO11.18)
DEBUG_RXD: Controller Core (U3.18), Debugging Interface (R26.2 Rx.1)
DEBUG_TXD: Controller Core (U3.17), Debugging Interface (R25.2 Tx.1)
DISTANCE_FRONT: Controller Core (U3.99), Sensors (C51.2 F.1 R35.2 R38.2)
DISTANCE_FRONT_EN: Controller Core (U3.49), Sensors (CO6.2)
DISTANCE_LEFT: Controller Core (U3.98), Sensors (C53.2 L.1 R37.2 R40.2)
DISTANCE_LEFT_EN: Controller Core (U3.1), Sensors (CO8.2)
DISTANCE_RIGHT: Controller Core (U3.97), Sensors (C52.2 R.1 R36.2 R39.2)
DISTANCE_RIGHT_EN: Controller Core (U3.75), Sensors (CO7.2)
I2C_INT_MOTION: Controller Core (U3.39), Sensors (U5.12)
I2C_SCL_MOTION: Controller Core (U3.24), Sensors (R44.1 U5.23), Display and IOs (CO11.16)
I2C_SDA_MOTION: Controller Core (U3.23), Sensors (R45.1 U5.24), Display and IOs (CO11.14)
LCD_BL: Controller Core (U3.58), Display and IOs (CO11.10)
LCD_DATACMD: Controller Core (U3.67), Display and IOs (CO11.7)
LCD_RESET: Controller Core (U3.68), Display and IOs (CO11.8)
LCD_SPI_CLK: Controller Core (U3.62), Display and IOs (CO11.3)
LCD_SPI_CS: Controller Core (U3.59), Display and IOs (CO11.9)
LCD_SPI_MISO: Controller Core (U3.66), Display and IOs (CO11.1)
LCD_SPI_MOSI: Controller Core (U3.65), Display and IOs (CO11.4)
LINE_FOLLOW_1: Controller Core (U3.54), Sensors (CO10.6)
LINE_FOLLOW_2: Controller Core (U3.53), Sensors (CO10.7)
LINE_FOLLOW_3: Controller Core (U3.55), Sensors (CO10.5)
LINE_FOLLOW_4: Controller Core (U3.56), Sensors (CO10.3)
LINE_FOLLOW_5: Controller Core (U3.57), Sensors (CO10.4)
NetC61_1: FHJController_V5.0_Main (C61.1 CO13.1 CO14.1), Power Supply (Q1.2 R1.2 R3.2)
NetCO12_2: FHJController_V5.0_Main (CO12.2), Debugging Interface (D5.4 R18.1)
NetCO12_3: FHJController_V5.0_Main (CO12.3), Debugging Interface (D5.2 R17.1)
RPM_SENSOR: Controller Core (U3.37), Sensors (CO9.2 D8.1 R41.1 RPM.1)
RPM_SENSOR_DIR: Controller Core (U3.38), Sensors (CO9.3 DIR.1 R42.1)
TARGET_RST_SBWTDIO: Controller Core (5 pins), Debugging Interface (R27.2)
TARGET_TEST_SBWTCK: Controller Core (U3.91), Debugging Interface (R28.2)
UART_RXD_AUX: Controller Core (U3.61), Display and IOs (CO11.15)
UART_TXD_AUX: Controller Core (R12.1 R13.1 U3.60), Display and IOs (CO11.13)
VBAT_MEASURE: Power Supply (C1.2 D1.3 R1.1 R2.2), Controller Core (U3.100)
VUSB: FHJController_V5.0_Main (CO12.1), Debugging Interface (D5.5 FB3.1)

## Assembly variants
FHJController V5.0 Full Assembled: all parts fitted
FHJController V5.0 Part Assembled: not fitted R12 R13 R41 R42 R46 R47